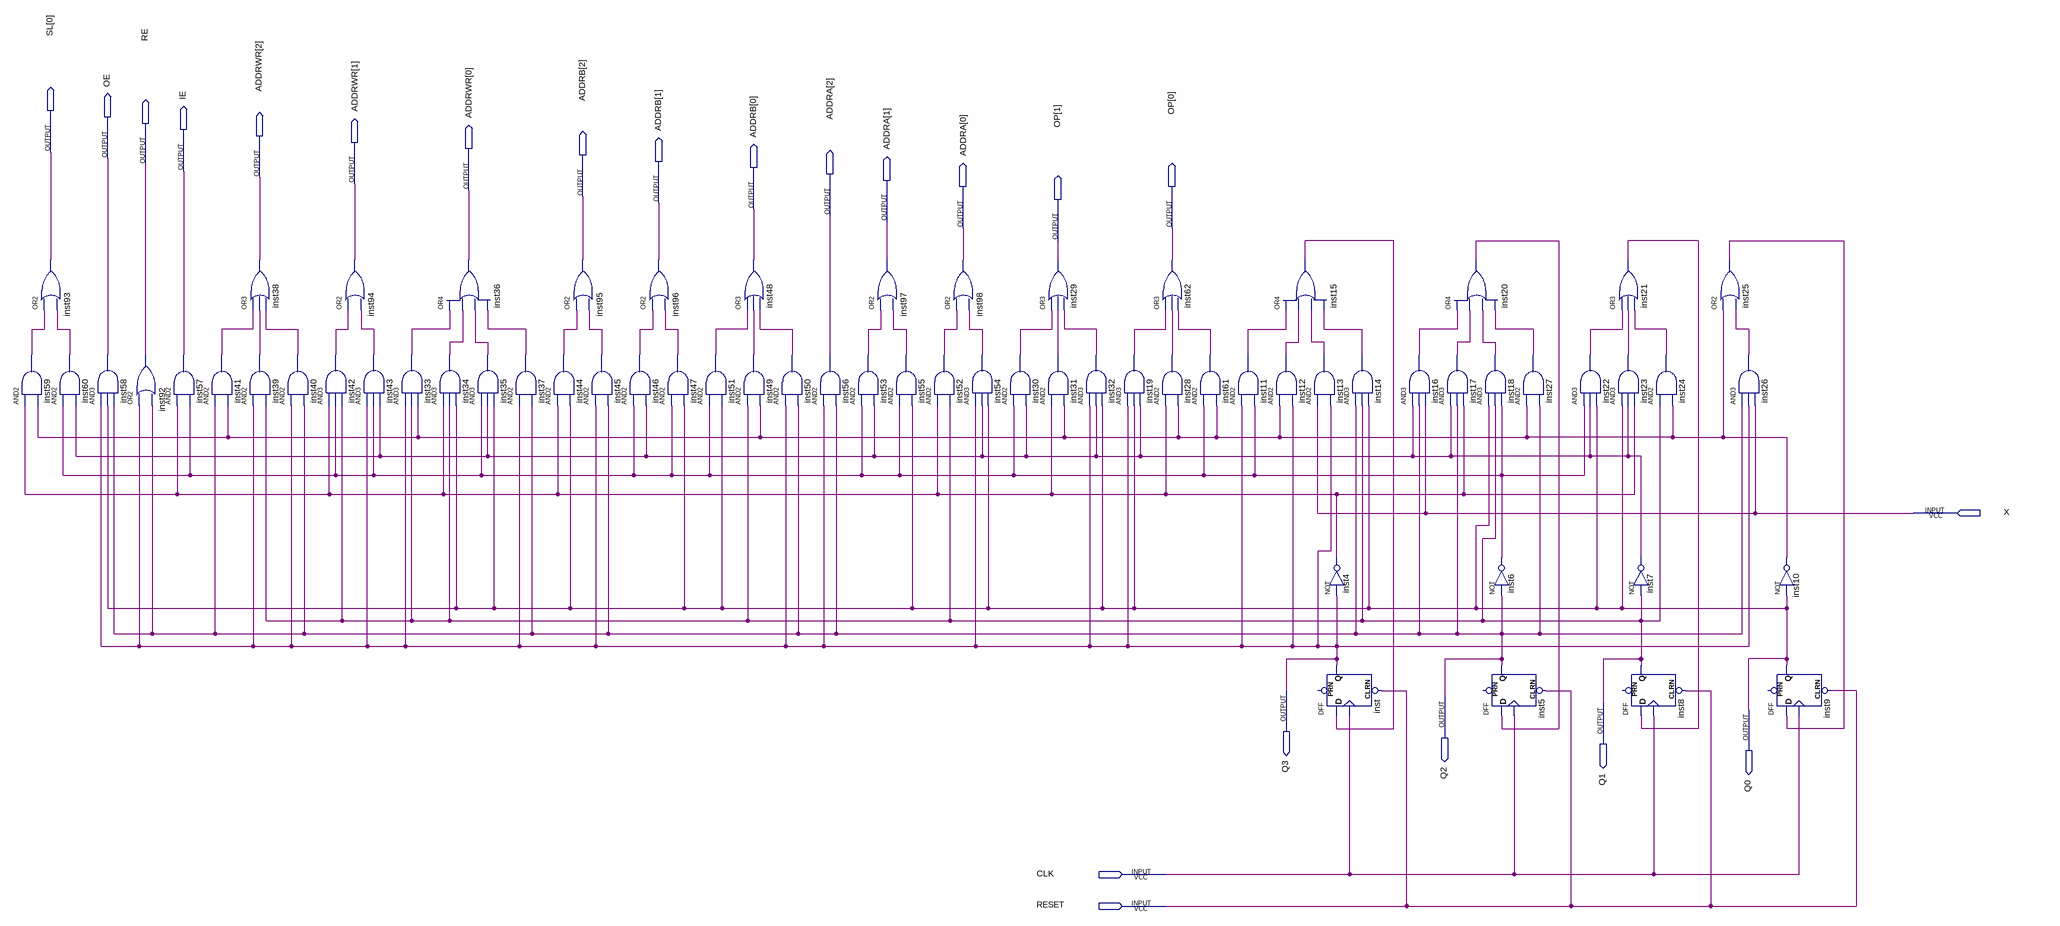
[diagram p0: schematic sheet]
// Quartus schematic Control.bdf as structural Verilog: 67 symbols, 22 pins
module Control (
  input  X,
  input  CLK,
  input  RESET,
  output [0:0] SL,
  output OE,
  output RE,
  output IE,
  output [2:0] ADDRWR,
  output [2:0] ADDRB,
  output [2:0] ADDRA,
  output [1:0] OP,
  output Q3,
  output Q2,
  output Q1,
  output Q0
);

  wire inst4_out, inst6_out, inst7_out, inst10_out, inst11_out, inst12_out, inst13_out, inst14_out,
       inst15_out, inst16_out, inst17_out, inst18_out, inst19_out, inst20_out, inst21_out, inst22_out,
       inst23_out, inst24_out, inst25_out, inst26_out, inst27_out, inst28_out, inst30_out, inst31_out,
       inst32_out, inst33_out, inst34_out, inst35_out, inst37_out, inst39_out, inst40_out, inst41_out,
       inst42_out, inst43_out, inst44_out, inst45_out, inst46_out, inst47_out, inst49_out, inst50_out,
       inst51_out, inst52_out, inst53_out, inst54_out, inst55_out, inst59_out, inst60_out, inst61_out;

  or inst93 (SL[0], inst59_out, inst60_out);
  and inst59 (inst59_out, inst4_out, inst10_out);
  and inst60 (inst60_out, inst6_out, inst7_out);
  and inst58 (OE, Q3, Q0, Q2);
  or inst92 (RE, Q3, Q2);
  and inst41 (inst41_out, Q2, inst10_out);
  and inst57 (IE, inst4_out, inst6_out);
  or inst38 (ADDRWR[2], inst41_out, inst39_out, inst40_out);
  and inst39 (inst39_out, Q3, Q1);
  and inst40 (inst40_out, Q3, Q2);
  or inst94 (ADDRWR[1], inst42_out, inst43_out);
  and inst42 (inst42_out, inst4_out, inst6_out, Q1);
  and inst43 (inst43_out, Q3, inst6_out, inst7_out);
  and inst33 (inst33_out, Q3, Q1, inst10_out);
  or inst36 (ADDRWR[0], inst33_out, inst34_out, inst35_out, inst37_out);
  and inst34 (inst34_out, inst4_out, Q1, Q0);
  and inst35 (inst35_out, inst6_out, inst7_out, Q0);
  and inst37 (inst37_out, Q3, Q2);
  or inst95 (ADDRB[2], inst44_out, inst45_out);
  and inst44 (inst44_out, inst4_out, Q0);
  and inst45 (inst45_out, Q3, Q2);
  or inst96 (ADDRB[1], inst46_out, inst47_out);
  and inst46 (inst46_out, inst6_out, inst7_out);
  and inst47 (inst47_out, inst6_out, Q0);
  and inst51 (inst51_out, inst6_out, Q0);
  or inst48 (ADDRB[0], inst51_out, inst49_out, inst50_out);
  and inst49 (inst49_out, Q1, inst10_out);
  and inst50 (inst50_out, Q3, Q2);
  and inst56 (ADDRA[2], Q3, Q2);
  or inst97 (ADDRA[1], inst53_out, inst55_out);
  and inst53 (inst53_out, inst6_out, inst7_out);
  and inst55 (inst55_out, inst6_out, Q0);
  or inst98 (ADDRA[0], inst52_out, inst54_out);
  and inst52 (inst52_out, inst4_out, Q1);
  and inst54 (inst54_out, Q3, inst7_out, Q0);
  and inst30 (inst30_out, inst6_out, inst7_out);
  or inst29 (OP[1], inst30_out, inst31_out, inst32_out);
  and inst31 (inst31_out, inst4_out, inst10_out);
  and inst32 (inst32_out, Q3, inst7_out, Q0);
  and inst19 (inst19_out, Q3, Q0, inst7_out);
  or inst62 (OP[0], inst19_out, inst28_out, inst61_out);
  and inst28 (inst28_out, inst4_out, inst10_out);
  and inst61 (inst61_out, inst6_out, inst10_out);
  or inst15 (inst15_out, inst11_out, inst12_out, inst13_out, inst14_out);
  and inst11 (inst11_out, Q3, inst6_out);
  and inst12 (inst12_out, inst10_out, Q3);
  and inst13 (inst13_out, X, Q3);
  not inst4 (inst4_out, Q3);
  DFF inst (.CLRN(RESET), .CLK(CLK), .D(inst15_out), .Q(Q3));  // open: PRN
  and inst14 (inst14_out, Q2, Q1, Q0);
  and inst16 (inst16_out, inst7_out, Q2, X);
  or inst20 (inst20_out, inst16_out, inst17_out, inst18_out, inst27_out);
  and inst17 (inst17_out, inst7_out, Q2, inst4_out);
  and inst18 (inst18_out, Q0, Q1, inst6_out);
  and inst27 (inst27_out, inst10_out, Q2);
  not inst6 (inst6_out, Q2);
  DFF inst5 (.CLRN(RESET), .CLK(CLK), .D(inst20_out), .Q(Q2));  // open: PRN
  and inst22 (inst22_out, inst6_out, inst7_out, Q0);
  or inst21 (inst21_out, inst22_out, inst23_out, inst24_out);
  and inst23 (inst23_out, Q0, inst7_out, inst4_out);
  not inst7 (inst7_out, Q1);
  DFF inst8 (.CLRN(RESET), .CLK(CLK), .D(inst21_out), .Q(Q1));  // open: PRN
  and inst24 (inst24_out, Q1, inst10_out);
  or inst25 (inst25_out, inst10_out, inst26_out);
  and inst26 (inst26_out, Q2, Q3, X);
  not inst10 (inst10_out, Q0);
  DFF inst9 (.CLRN(RESET), .CLK(CLK), .D(inst25_out), .Q(Q0));  // open: PRN
endmodule
